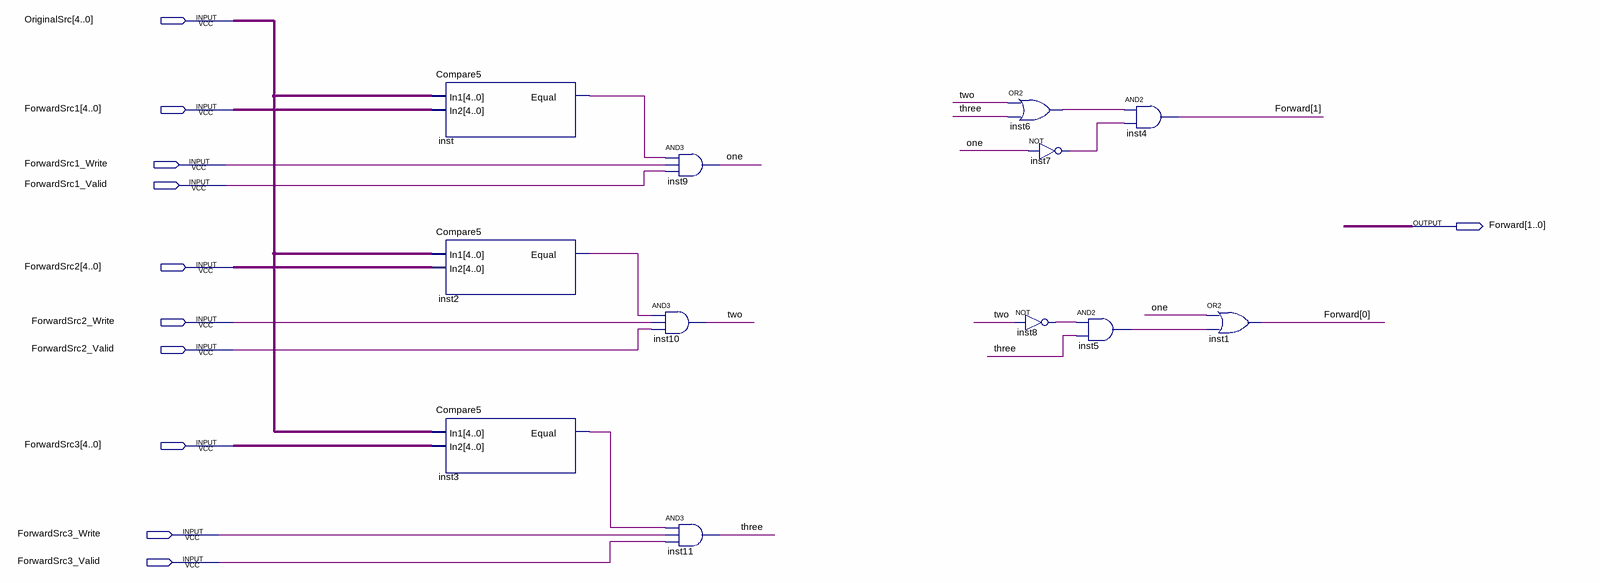
[diagram p0: schematic sheet]
// Quartus schematic Forwarding_Unit.bdf as structural Verilog: 12 symbols, 11 pins
module Forwarding_Unit (
  input  [4:0] OriginalSrc,
  input  [4:0] ForwardSrc1,
  input  ForwardSrc1_Write,
  input  ForwardSrc1_Valid,
  input  [4:0] ForwardSrc2,
  input  ForwardSrc2_Write,
  input  ForwardSrc2_Valid,
  input  [4:0] ForwardSrc3,
  input  ForwardSrc3_Write,
  input  ForwardSrc3_Valid,
  output [1:0] Forward
);

  wire inst2_equal, inst3_equal, inst5_out, inst6_out, inst7_out, inst8_out, inst_equal, one, three, two;

  Compare5 inst (.In1(OriginalSrc), .In2(ForwardSrc1), .Equal(inst_equal));
  Compare5 inst2 (.In1(OriginalSrc), .In2(ForwardSrc2), .Equal(inst2_equal));
  Compare5 inst3 (.In1(OriginalSrc), .In2(ForwardSrc3), .Equal(inst3_equal));
  and inst10 (two, inst2_equal, ForwardSrc2_Write, ForwardSrc2_Valid);
  and inst9 (one, inst_equal, ForwardSrc1_Write, ForwardSrc1_Valid);
  and inst11 (three, inst3_equal, ForwardSrc3_Write, ForwardSrc3_Valid);
  or inst6 (inst6_out, two, three);
  not inst7 (inst7_out, one);
  not inst8 (inst8_out, two);
  and inst5 (inst5_out, inst8_out, three);
  and inst4 (Forward[1], inst6_out, inst7_out);
  or inst1 (Forward[0], one, inst5_out);
endmodule
